# EAGLE design a (EAGLE 9.6.2)
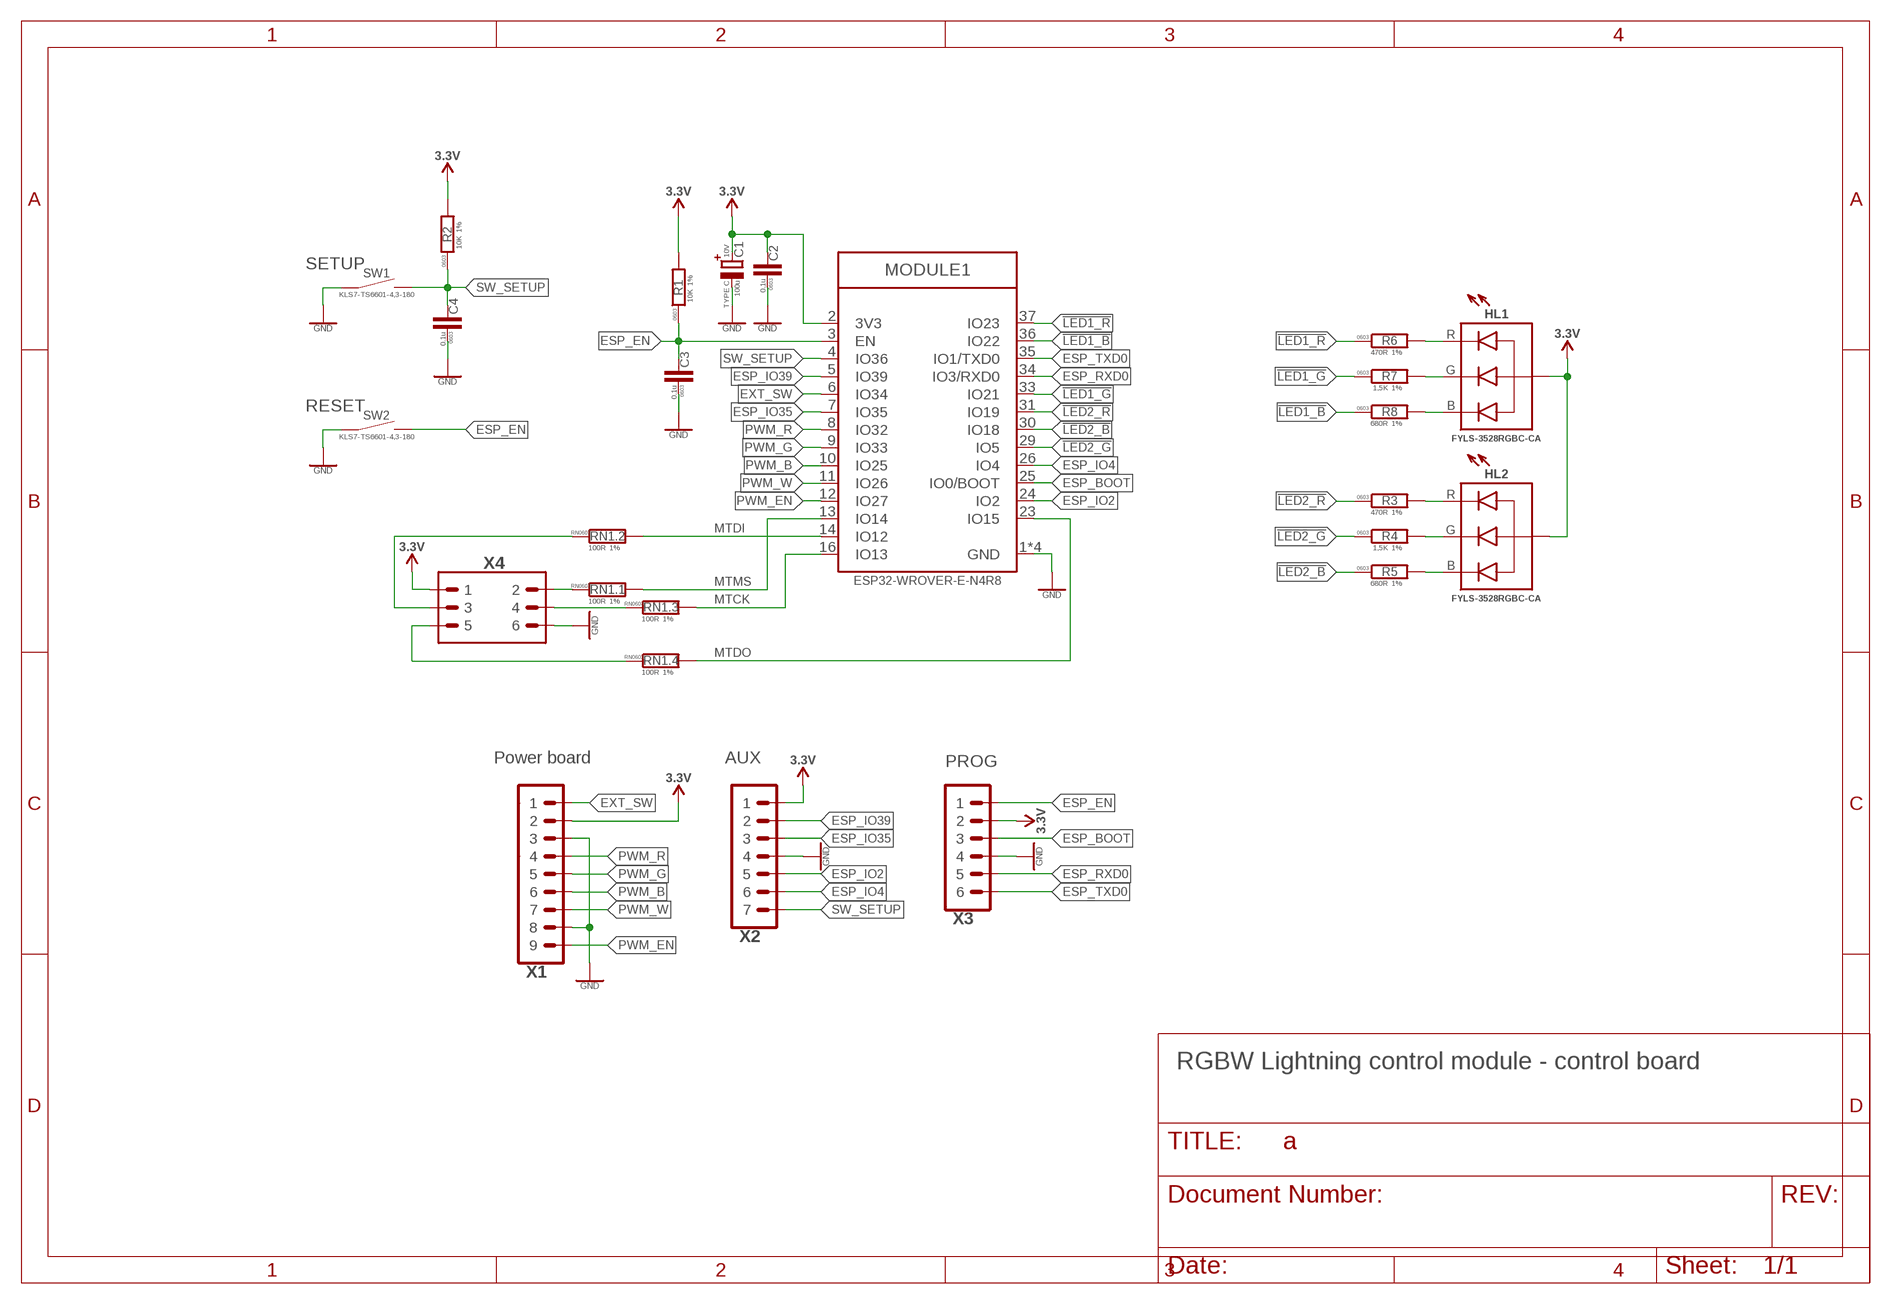
[diagram p0: schematic, sheet 1]

## Parts
C1  100u  CPOL-TANT-TYPE-C  [CTANT_TYPE_C]
C2  0.1u  C-0603  [C0603]
C3  0.1u  C-0603  [C0603]
C4  0.1u  C-0603  [C0603]
HL1  LED_RGB-3528  [LED3528]
HL2  LED_RGB-3528  [LED3528]
MODULE1  ESP32-WROVER-(I)E  [ESP32-WROVER-E]
R1  10K  R-1%-0603  [R0603]
R2  10K  R-1%-0603  [R0603]
R3  470R  R-1%-0603  [R0603]
R4  1,5K  R-1%-0603  [R0603]
R5  680R  R-1%-0603  [R0603]
R6  470R  R-1%-0603  [R0603]
R7  1,5K  R-1%-0603  [R0603]
R8  680R  R-1%-0603  [R0603]
RN1  100R  RN-1%-0603  [R_4X0603]
SW1  TS6601-9,5  TACT_SWITCH-6X6-PTH  [SW4-6.0X6.0X5.0MM]
SW2  TS6601-9,5  TACT_SWITCH-6X6-PTH  [SW4-6.0X6.0X5.0MM]
X1  PINHEAD_1X09-2.54-TH-MALE  [1X09-PTH-2.54]
X2  PINHEAD_1X07-2.54  [1X07-PTH-2.54]
X3  PINHEAD_1X06-2-MALE  [1X06-PTH-2]
X4  PINHEAD_2X03-PTH-2.54  [2X03-PTH-2.54]

## Nets
!LED1_B: MODULE1.36(IO22) R8.1
!LED1_G: MODULE1.33(IO21) R7.1
!LED1_R: MODULE1.37(IO23) R6.1
!LED2_B: MODULE1.30(IO18) R5.1
!LED2_G: MODULE1.29(IO5) R4.1
!LED2_R: MODULE1.31(IO19) R3.1
ESP_BOOT: MODULE1.25(IO0/BOOT) X3.3
ESP_EN: C3.2 MODULE1.3(EN) R1.1 SW2.2 SW2.3 X3.1
ESP_IO2: MODULE1.24(IO2) X2.5
ESP_IO4: MODULE1.26(IO4) X2.6
ESP_IO35: MODULE1.7(IO35) X2.3
ESP_IO39: MODULE1.5(IO39) X2.2
ESP_RXD0: MODULE1.34(IO3/RXD0) X3.5
ESP_TXD0: MODULE1.35(IO1/TXD0) X3.6
EXT_SW: MODULE1.6(IO34) X1.1
GND: C1.- C2.1 C3.1 C4.1 MODULE1.1(GND) MODULE1.15(GND) MODULE1.38(GND) MODULE1.39(GND) SW1.1 SW1.4 SW2.1 SW2.4 X1.3 X1.8 X2.4 X3.4 X4.6
MTCK: MODULE1.16(IO13) RN1.6
MTDI: MODULE1.14(IO12) RN1.7
MTDI_J: RN1.2 X4.3
MTDO: MODULE1.23(IO15) RN1.5
MTMS: MODULE1.13(IO14) RN1.8
N$1: HL2.1(R) R3.2
N$2: HL1.4(G) R7.2
N$3: HL1.1(R) R6.2
N$4: HL1.3(B) R8.2
N$5: HL2.4(G) R4.2
N$6: RN1.1 X4.2
N$7: RN1.3 X4.4
N$8: RN1.4 X4.5
N$9: HL2.3(B) R5.2
PWM_B: MODULE1.10(IO25) X1.6
PWM_EN: MODULE1.12(IO27) X1.9
PWM_G: MODULE1.9(IO33) X1.5
PWM_R: MODULE1.8(IO32) X1.4
PWM_W: MODULE1.11(IO26) X1.7
SW_SETUP: C4.2 MODULE1.4(IO36) R2.1 SW1.2 SW1.3 X2.7
VDD_3V3: C1.+ C2.2 HL1.2(A) HL2.2(A) MODULE1.2(3V3) R1.2 R2.2 X1.2 X2.1 X3.2 X4.1 ; supply symbol labelled 3.3V

## Notes on the sheet
- SETUP
- RESET
- Power board | AUX | PROG
- RGBW Lightning control module - control board

## Library data of the parts
C1 = rc:CPOL: Polar electrolytic or tantalum capacitor; PACKAGE: TYPE C; VOLTAGE: 10V
C2-C4 = rc:C; PACKAGE: 0603
HL1 HL2 = rc:LED_RGB; MANF: Foryard; MANF#: FYLS-3528RGBC-CA
MODULE1 = ali_modules:ESP32-WROVER-(I)E: ESP32-WROVER-(I)E module Datasheet <https://documentation.espressif.com/esp32-wrover-e_esp32-wrover-ie_datasheet_en.pdf>; MANF: Espressif Systems; MANF#: ESP32-WROVER-E-N4R8
R1-R8 = rc:R; PACKAGE: 0603; TOLERANCE: 1%
RN1 = rc:RN; PACKAGE: RN0603; TOLERANCE: 1%
SW1 SW2 = mechanical:TACT_SWITCH: tact switch; MANF: KLS; MANF#: KLS7-TS6601-4,3-180
X1 = pinhead:PINHEAD_1X09
X2 = pinhead:PINHEAD_1X07: pinheader 7P
X3 = pinhead:PINHEAD_1X06: pinheader 6P
X4 = pinhead:PINHEAD_2X03

## Net classes
1 24V: clearance 0.305 mm
12 Vbat: width 0.229 mm, clearance 0.305 mm

## Board
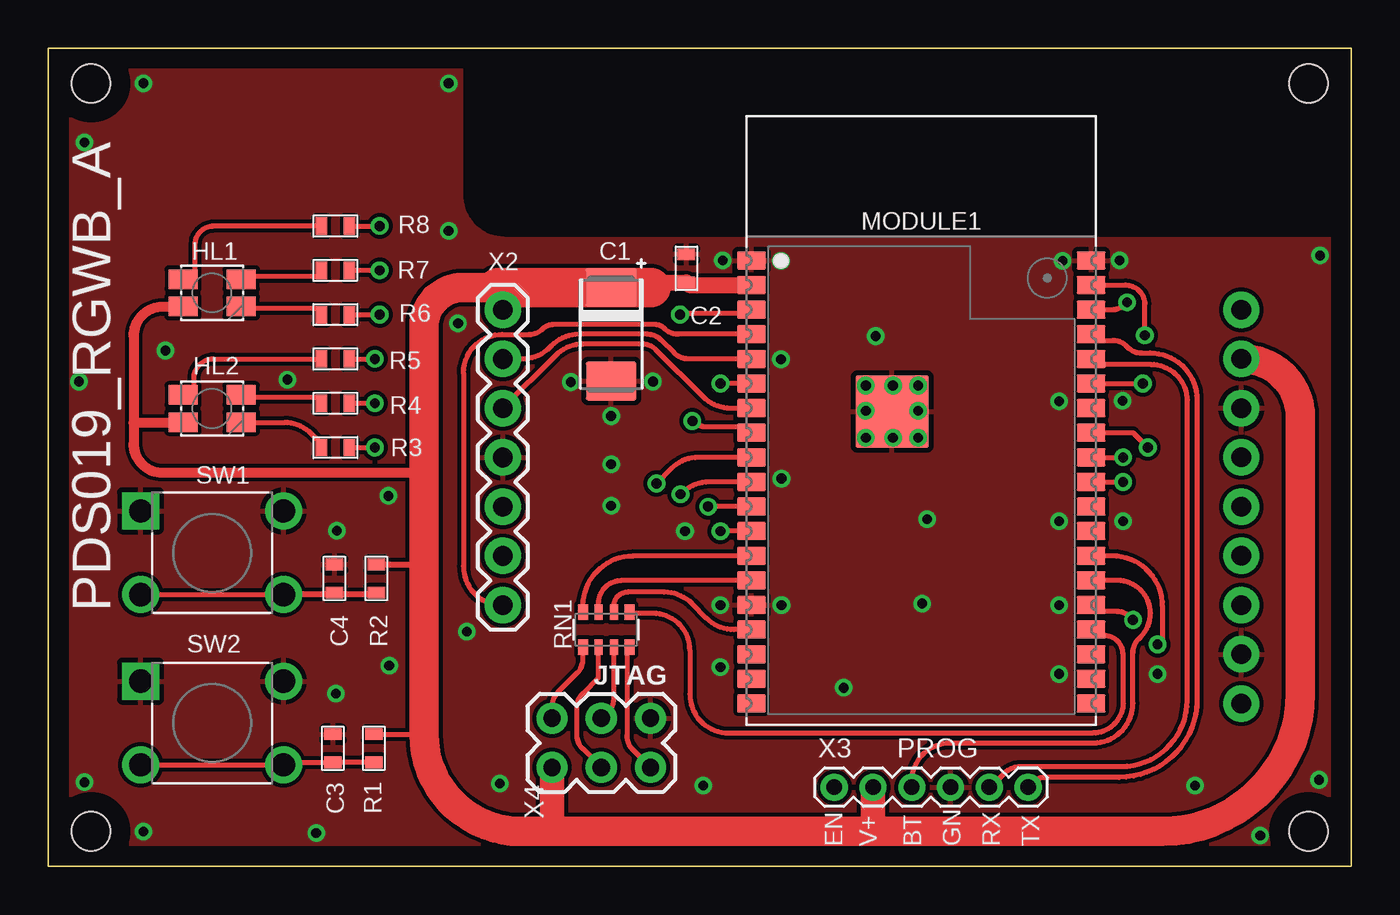
[diagram p1: board, top side]
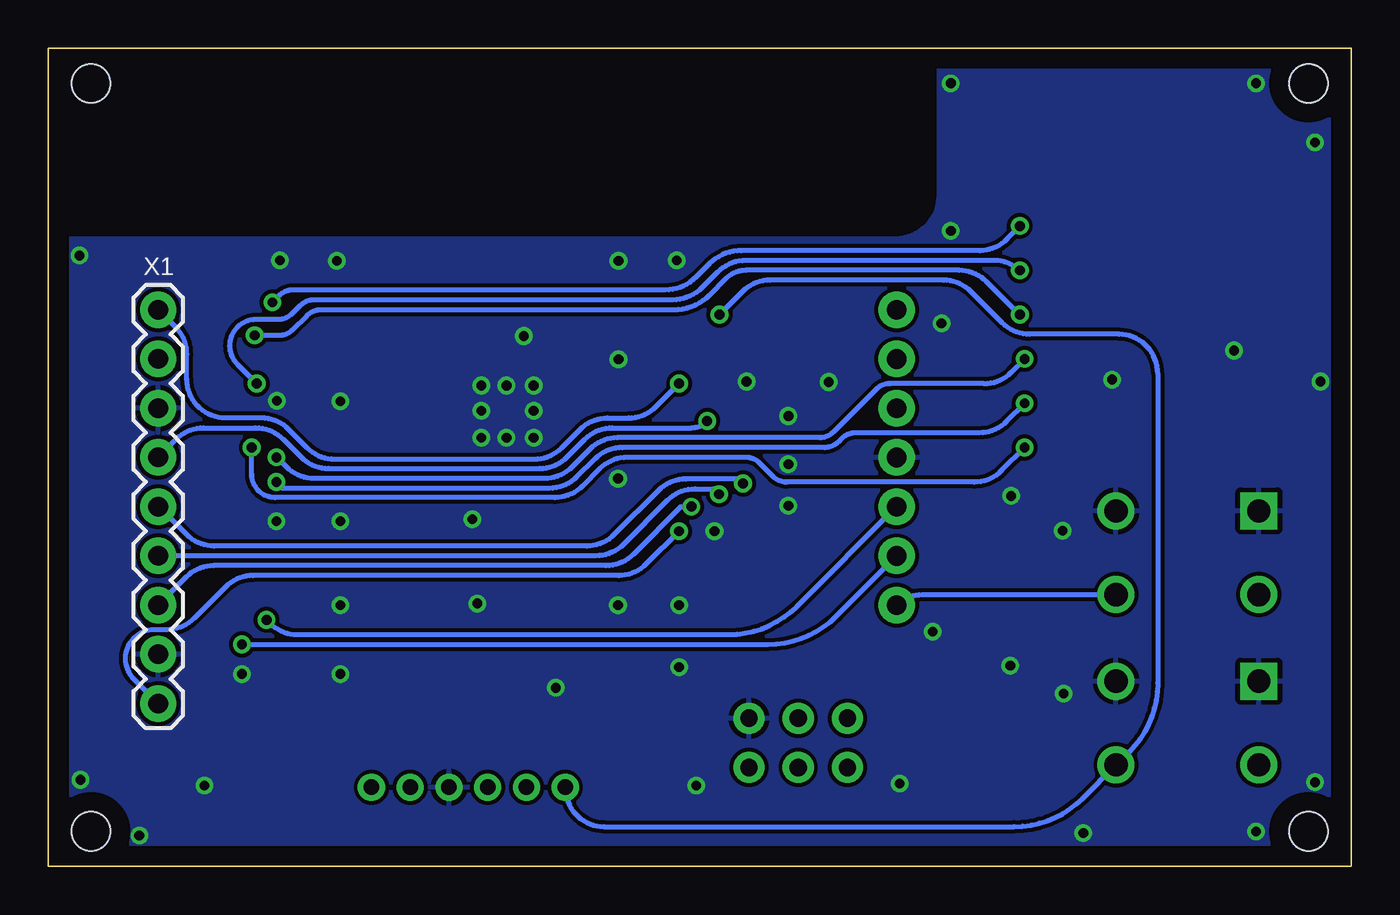
[diagram p2: board, bottom side, seen from below]

Size 67.2 x 42.2 mm. Coordinates in mm from the lower left corner, seen from the top.
Outline: 0,42.2 67.2,42.2 67.2,0 0,0 0,42.2
Copper layers (1*16): Top 0.035mm / dielectric 1.5mm / Bottom 0.035mm
Design rules "pds019_rgbw *": minimum track width 8mil, minimum drill 0.5mm, track to track 8mil, track to pad 8mil, pad to pad 8mil, via to via 8mil, smd to smd 0mil, copper to edge 40mil, drill to drill 8mil, minimum pad ring 10mil, minimum via ring 8mil, stop-mask expansion 4mil, vias tented up to drill 2mm, thermal gap 10mil
Holes 2 mm at 2.2,40.4 65,40.4 65,1.8 2.2,1.8
tRestrict: 3 lines
bRestrict: 3 lines

### Footprints (pad centres in the part's own frame; a part is rotated, then mirrored left to right if it is on the bottom)
CTANT_TYPE_C = smd 1.981 x 2.591: + -2.413,0; - 2.413,0
C0603 = smd 0.6 x 0.9: 1 -0.725,0; 2 0.725,0
LED3528 = smd 1.5 x 1: 1 1.5,-0.7; 2 -1.5,-0.7; 3 -1.5,0.7; 4 1.5,0.7
ESP32-WROVER-E = smd 1.473 x 0.914: 1 -8.763,8.255; 2 -8.763,6.985; 3 -8.763,5.715; 4 -8.763,4.445; 5 -8.763,3.175; 6 -8.763,1.905; 7 -8.763,0.635; 8 -8.763,-0.635; 9 -8.763,-1.905; 10 -8.763,-3.175; 11 -8.763,-4.445; 12 -8.763,-5.715; 13 -8.763,-6.985; 14 -8.763,-8.255; 15 -8.763,-9.525; 16 -8.763,-10.795; 17 -8.763,-12.065; 18 -8.763,-13.335; 19 -8.763,-14.605; 20 8.763,-14.605; 21 8.763,-13.335; 22 8.763,-12.065; 23 8.763,-10.795; 24 8.763,-9.525; 25 8.763,-8.255; 26 8.763,-6.985; 27 8.763,-5.715; 28 8.763,-4.445; 29 8.763,-3.175; 30 8.763,-1.905; 31 8.763,-0.635; 32 8.763,0.635; 33 8.763,1.905; 34 8.763,3.175; 35 8.763,4.445; 36 8.763,5.715; 37 8.763,6.985; 38 8.763,8.255 | smd 3.75 x 3.75: 39 -1.5,0.455
R0603 = smd 0.6 x 0.9: 1 -0.725,0; 2 0.725,0
R_4X0603 = smd 0.8 x 0.5: 1 -0.9,1.2; 4 -0.9,-1.2; 5 0.9,-1.2; 8 0.9,1.2 | smd 0.8 x 0.4: 2 -0.9,0.4; 3 -0.9,-0.4; 6 0.9,-0.4; 7 0.9,0.4
SW4-6.0X6.0X5.0MM = drill 1.2 pad 1.905 square: 1 -3.683,2.159 | drill 1.2 pad 1.905: 2 -3.683,-2.159; 3 3.683,-2.159; 4 3.683,2.159
1X09-PTH-2.54 = drill 1.016 pad 1.88: 1 -10.16,0; 2 -7.62,0; 3 -5.08,0; 4 -2.54,0; 5 0,0; 6 2.54,0; 7 5.08,0; 8 7.62,0; 9 10.16,0
1X07-PTH-2.54 = drill 1.016 pad 1.88: 1 -7.62,0; 2 -5.08,0; 3 -2.54,0; 4 0,0; 5 2.54,0; 6 5.08,0; 7 7.62,0
1X06-PTH-2 = drill 0.8 pad 1.4: 1 -5,0; 2 -3,0; 3 -1,0; 4 1,0; 5 3,0; 6 5,0
2X03-PTH-2.54 = drill 0.9 pad 1.6: 1 -1.27,2.54; 2 1.27,2.54; 3 -1.27,0; 4 1.27,0; 5 -1.27,-2.54; 6 1.27,-2.54

### Placement (x,y rotation side)
C1  29.03,27.45 270 top
C2  32.91,30.85 270 top
C3  14.68,6.09 270 top
C4  14.75,14.85 270 top
HL1  8.44,29.59 0 top
HL2  8.44,23.62 0 top
MODULE1  45.03,23.01 0 top
PCB1  [D4MG_PCB_UP]  33.6,21.1 0 top
R1  16.79,6.09 90 top
R2  16.91,14.85 90 top
R3  14.8,21.61 180 top
R4  14.8,23.89 180 top
R5  14.8,26.18 180 top
R6  14.8,28.47 180 top
R7  14.8,30.75 180 top
R8  14.8,33.04 180 top
RN1  28.77,12.21 90 top
SW1  8.44,16.18 0 top
SW2  8.44,7.39 0 top
X1  61.54,18.56 270 bottom
X2  23.44,21.09 270 top
X3  45.54,4.08 0 top
X4  28.52,6.37 90 top

### Tracks (layer width: path | path; a pad name or v marks a point on that pad's centre or on a via)
!LED1_B  (via drill 0.51)
  Top 0.254: MODULE1.36 54.86,28.72 arc45 55.56,29.02 v55.65,29.1 | R8.1 v17.09,33.04
  Bottom 0.254: v17.09,33.04 17.09,33.01 17.75,32.35 arc45 19.16,31.77 31.46,31.77 arc-45 33.1,31.09 33.79,30.4 arc45 35.38,29.74 54.6,29.74 arc-45 55.3,29.44 v55.65,29.1
!LED1_G  (via drill 0.51)
  Top 0.254: MODULE1.33 v56.46,24.91 | R7.1 v17.09,30.75
  Bottom 0.254: v17.09,30.75 17.13,30.75 arc-45 18.35,31.26 31.22,31.26 arc-45 32.69,30.65 33.48,29.86 arc45 35,29.23 53.51,29.23 arc-45 54.21,28.94 54.64,28.51 arc45 55.35,28.21 56.51,28.21 arc-135 57.46,25.91 v56.46,24.91
!LED1_R  (via drill 0.51)
  Top 0.254: v56.56,27.4 56.56,28.99 arc90 55.56,29.99 MODULE1.37 | R6.1 v17.09,28.47
  Bottom 0.254: v17.09,28.47 17.11,28.47 18.81,30.17 arc-45 20.22,30.75 31.2,30.75 arc-45 32.26,30.31 33.09,29.48 arc45 34.94,28.72 53.15,28.72 arc-45 53.86,28.43 54.59,27.69 arc45 55.3,27.4 v56.56,27.4
!LED2_B  (via drill 0.51)
  Top 0.254: MODULE1.30 v55.44,21.1 | R5.1 v16.84,26.18
  Bottom 0.254: v55.44,21.1 55.41,21.1 54.91,20.6 arc-45 53.5,20.02 41.61,20.02 arc-45 40.2,20.6 39.27,21.53 arc45 37.85,22.12 27.41,22.12 arc-45 26.7,22.41 24.5,24.61 arc45 23.79,24.91 18.93,24.91 arc-45 17.52,25.49 v16.84,26.17 v16.84,26.18
!LED2_G  (via drill 0.51)
  Top 0.254: MODULE1.29 v55.44,19.83 | R4.1 v16.84,23.89
  Bottom 0.254: v16.84,23.89 17.77,22.95 arc45 19.19,22.37 25.57,22.37 arc-45 26.28,22.07 26.45,21.9 arc45 27.16,21.61 37.6,21.61 arc-45 39.01,21.02 39.94,20.09 arc45 41.36,19.51 55.1,19.51 55.42,19.83 v55.44,19.83
!LED2_R  (via drill 0.51)
  Top 0.254: v56.71,21.61 55.95,22.37 MODULE1.31 | R3.1 v16.84,21.61
  Bottom 0.254: v16.84,21.61 v16.84,21.6 18.03,20.41 arc45 19.44,19.83 29.12,19.83 arc45 29.82,20.12 30.51,20.81 arc-45 31.22,21.1 37.34,21.1 arc-45 38.76,20.51 39.66,19.62 arc45 41.07,19.03 55.51,19.03 arc90 56.71,20.23 v56.71,21.61
ESP_BOOT
  Top 0.254: X3.3 44.54,4.38 arc-90 46.52,6.37 53.9,6.37 arc90 55.95,8.42 55.95,11.03 arc-45 56.25,11.74 56.35,11.85 arc135 55.15,14.75 MODULE1.25
ESP_EN  (via drill 0.51)
  Top 0.254: SW2.2 SW2.3 12.26,5.36 C3.2 R1.1 | MODULE1.3 36.06,28.52 32.64,28.52 v32.58,28.47
  Bottom 0.254: X3.1 40.54,4.05 arc-90 38.54,2.05 17.38,2.05 arc-45 13.84,3.51 SW2.3 11.44,5.91 arc-45 9.98,9.45 9.98,25.45 arc-90 11.98,27.45 16.57,27.45 arc45 17.99,28.04 19.61,29.66 arc-45 21.02,30.24 29.98,30.24 arc-45 31.39,29.66 v32.58,28.47
ESP_IO2  (via drill 0.51)
  Top 0.254: v55.95,12.72 55.8,12.87 arc45 55.12,13.15 54.12,13.15 MODULE1.24
  Bottom 0.254: v55.95,12.72 55.78,12.54 arc-45 54.36,11.96 32.11,11.96 arc-45 28.58,13.42 X2.5
ESP_IO4  (via drill 0.51)
  Top 0.254: v57.22,11.45 57.48,11.7 57.48,13.41 arc90 54.87,16.02 MODULE1.26
  Bottom 0.254: v57.22,11.45 30.08,11.45 arc-45 26.55,12.91 X2.6
ESP_IO35
  Top 0.254: X2.3 26.16,26.36 arc-45 27.57,26.94 30.65,26.94 arc-45 31.35,26.65 33.77,24.23 arc45 35.19,23.64 36.06,23.64 36.16,23.54 MODULE1.7
ESP_IO39
  Top 0.254: MODULE1.5 33,26.18 arc-45 32.29,26.48 31.61,27.16 arc45 30.9,27.45 27.37,27.45 arc45 25.95,26.86 25.85,26.76 arc-45 24.43,26.18 X2.2
ESP_RXD0
  Top 0.254: X3.5 48.59,4.08 49.31,4.8 arc-45 50.14,5.15 55.35,5.15 arc90 58.75,8.55 58.75,24.01 arc90 56.86,25.9 54.07,25.9 MODULE1.34
ESP_TXD0
  Top 0.254: X3.6 50.54,4.11 50.72,4.3 arc-45 51.43,4.59 55.23,4.59 arc90 59.25,8.61 59.25,24.06 arc90 56.83,26.48 56.39,26.48 arc-45 55.69,26.78 55.62,26.85 arc45 54.91,27.14 54.11,27.14 MODULE1.35
EXT_SW  (via drill 0.51)
  Top 0.254: MODULE1.6 v34.67,24.91
  Bottom 0.254: v34.67,24.91 35.86,23.72 arc45 37.27,23.13 38.36,23.13 arc-45 39.77,22.55 40.73,21.59 arc45 42.14,21.01 52.43,21.01 arc45 53.84,21.59 54.8,22.55 arc-45 56.21,23.13 58.06,23.13 arc90 60.06,25.13 60.06,26.41 arc-45 60.65,27.83 X1.1
GND  (via drill 0.5)
  other vias: 34.79,31.26 55.27,31.26 52.32,31.23 37.79,31.23 34.67,13.48 37.82,13.48 13.81,1.72 4.9,40.4 20.65,40.4 31.19,25.01 26.95,24.99 52.14,13.48 37.82,20.01 37.79,26.15 52.14,24 32.84,17.29 29.03,23.23 65.6,31.51 55.42,24.02 1.85,37.36 1.85,4.34 4.9,1.8 59.15,4.16 20.65,32.78 34.67,10.27 55.44,17.8 21.13,28.01 52.14,17.8 52.14,9.92 29.03,20.74 29.03,18.61 57.22,9.92 62.52,1.58 65.55,4.46 42.17,24.81 44.87,24.81 44.87,22.11 42.17,22.11 42.17,23.51 44.87,23.51 43.57,24.81 43.57,22.11 14.88,17.31 14.83,8.91 17.53,19.11 17.58,10.36 21.58,12.11 23.28,4.26 33.78,4.16 41.03,9.21 45.08,13.56 45.33,17.91 42.68,27.36 1.58,25.01 6.03,26.61 12.33,25.11
  pour Bottom: 0.58,41.67 66.62,41.67 66.62,0.53 0.58,0.53
  pour Top: 0.58,41.67 66.62,41.67 66.62,0.53 0.58,0.53
MTCK
  Top 0.254: MODULE1.16 35.37,12.21 arc-45 33.95,12.8 33.19,13.56 arc45 31.77,14.15 29.87,14.15 arc90 29.17,13.45 RN1.6
MTDI
  Top 0.254: MODULE1.14 29.57,14.75 arc90 28.37,13.55 RN1.7
MTDI_J
  Top 0.254: X4.3 27.54,6.08 arc-45 27.25,6.78 27.25,8.2 arc-45 27.54,8.91 28.37,9.74 RN1.2
MTDO
  Top 0.254: MODULE1.23 54.09,11.91 54.44,11.91 arc-90 55.44,10.91 55.44,8.45 arc-90 53.87,6.88 35.09,6.88 arc-90 33.09,8.88 33.09,11.15 arc90 31.19,13.05 30.03,13.05 RN1.5
MTMS
  Top 0.254: MODULE1.13 30.17,16.02 arc90 27.57,13.42 RN1.8
N$1
  Top 0.254: R3.2 14.08,21.81 13.58,22.31 arc45 12.16,22.9 10.44,22.9 10.42,22.92 HL2.1
N$2
  Top 0.254: R7.2 14.08,30.47 9.99,30.47 9.94,30.41 HL1.4
N$3
  Top 0.254: R6.2 14.08,28.78 9.92,28.78 9.84,28.87 9.92,28.87 HL1.1
N$4
  Top 0.254: R8.2 8.52,33.04 arc90 7.57,32.09 7.57,30.29 HL1.3
N$5
  Top 0.254: R4.2 14.08,24.22 10.47,24.22 10.37,24.32 HL2.4
N$6
  Top 0.254: X4.2 25.98,8.26 arc-45 26.27,8.97 27.28,9.97 arc45 27.57,10.68 RN1.1
N$7
  Top 0.254: RN1.3 29.17,8.68 arc-45 28.88,7.98 28.54,7.64 X4.4
N$8
  Top 0.254: X4.5 30.13,6.03 arc-45 29.84,6.73 29.84,11.18 RN1.4
N$9
  Top 0.254: R5.2 8.51,26.18 arc90 7.51,25.18 7.51,24.35 6.96,24.35 HL2.3
PWM_B  (via drill 0.51)
  Top 0.254: v32.61,19.2 32.66,19.24 arc-45 34.07,19.83 MODULE1.10
  Bottom 0.254: X1.6 38.96,16.02 arc-45 37.54,16.61 35.26,18.89 arc45 33.84,19.48 32.89,19.48 v32.61,19.2
PWM_EN  (via drill 0.51)
  Top 0.254: MODULE1.12 v34.67,17.29
  Bottom 0.254: v34.67,17.29 36.36,15.59 arc45 37.78,15 56.65,15 arc-45 58.06,14.42 59.68,12.8 arc45 61.1,12.21 61.75,12.21 arc-135 62.8,9.68 61.54,8.41 X1.9
PWM_G  (via drill 0.51)
  Top 0.254: v31.37,19.75 32.12,20.51 arc-45 33.54,21.1 MODULE1.9
  Bottom 0.254: X1.5 61.51,18.56 60.07,17.11 arc-45 58.65,16.53 39.43,16.53 arc-45 38.01,17.11 35.73,19.4 arc45 34.31,19.98 31.53,19.98 31.37,19.82 v31.37,19.75
PWM_R  (via drill 0.51)
  Top 0.254: MODULE1.8 35.96,22.67 33.94,22.67 arc-45 33.23,22.96 v33.22,22.98
  Bottom 0.254: X1.4 60.61,22.04 arc45 59.2,22.62 56.51,22.62 arc45 55.1,22.04 54.17,21.11 arc-45 52.76,20.53 41.86,20.53 arc-45 40.45,21.11 39.52,22.04 arc45 38.11,22.62 34.02,22.62 arc-45 33.22,22.96 v33.22,22.98
PWM_W  (via drill 0.51)
  Top 0.254: MODULE1.11 v34.03,18.56
  Bottom 0.254: v34.03,18.56 34.56,18.56 37.02,16.1 arc45 38.44,15.51 58.68,15.51 arc-45 60.09,14.93 X1.7
SW_SETUP
  Top 0.254: X2.7 23.41,13.48 arc-90 21.41,15.48 21.41,25.45 arc-90 23.41,27.45 24.8,27.45 arc45 25.51,27.74 arc-45 26.04,27.96 31.27,27.96 arc-45 31.78,27.75 arc45 32.49,27.45 MODULE1.4 | SW1.2 SW1.3
  Top 0.3: R2.1 16.81,14.03 14.85,14.03 C4.2 14.65,14.03 SW1.3
  Bottom 0.254: X2.7 arc45 22.12,14.02 SW1.3
VDD_3V3
  Top 0.254: 19.07,15.72 19.38,16.02 | R1.2 19.36,6.81 19.38,6.8
  Top 0.3: R2.2 18.93,15.58 19.07,15.72
  Top 0.508: 4.39,22.88 4.39,27.37 arc-90 5.89,28.87 6.92,28.87 HL1.2 | 4.39,22.88 4.39,21.81 arc90 5.89,20.31 19.38,20.31 | HL2.2 6.9,22.88 4.39,22.88
  Top 0.813: 31.09,29.86 31.35,30.13 C2.2 33.05,29.99 MODULE1.2
  Top 1: X2.1 23.19,28.97 23.19,29.86
  Top 1.27: X4.1 25.98,1.8 | X3.2 42.54,2 42.74,1.8
  Top 1.524: X1.2 61.59,26.18 arc-90 64.59,23.18 64.59,8.94 arc-90 57.45,1.8 42.74,1.8 25.98,1.8 24.38,1.8 arc-90 19.38,6.8 19.38,16.02 19.38,20.31 19.38,27.86 arc-90 21.38,29.86 23.19,29.86
  Top 2.032: 31.09,29.86 C1.+ 23.19,29.86

### Text on the board
tPlace: PDS019_RGWB_A | JTAG | PROG | EN | V+ | BT | GN | RX | TX